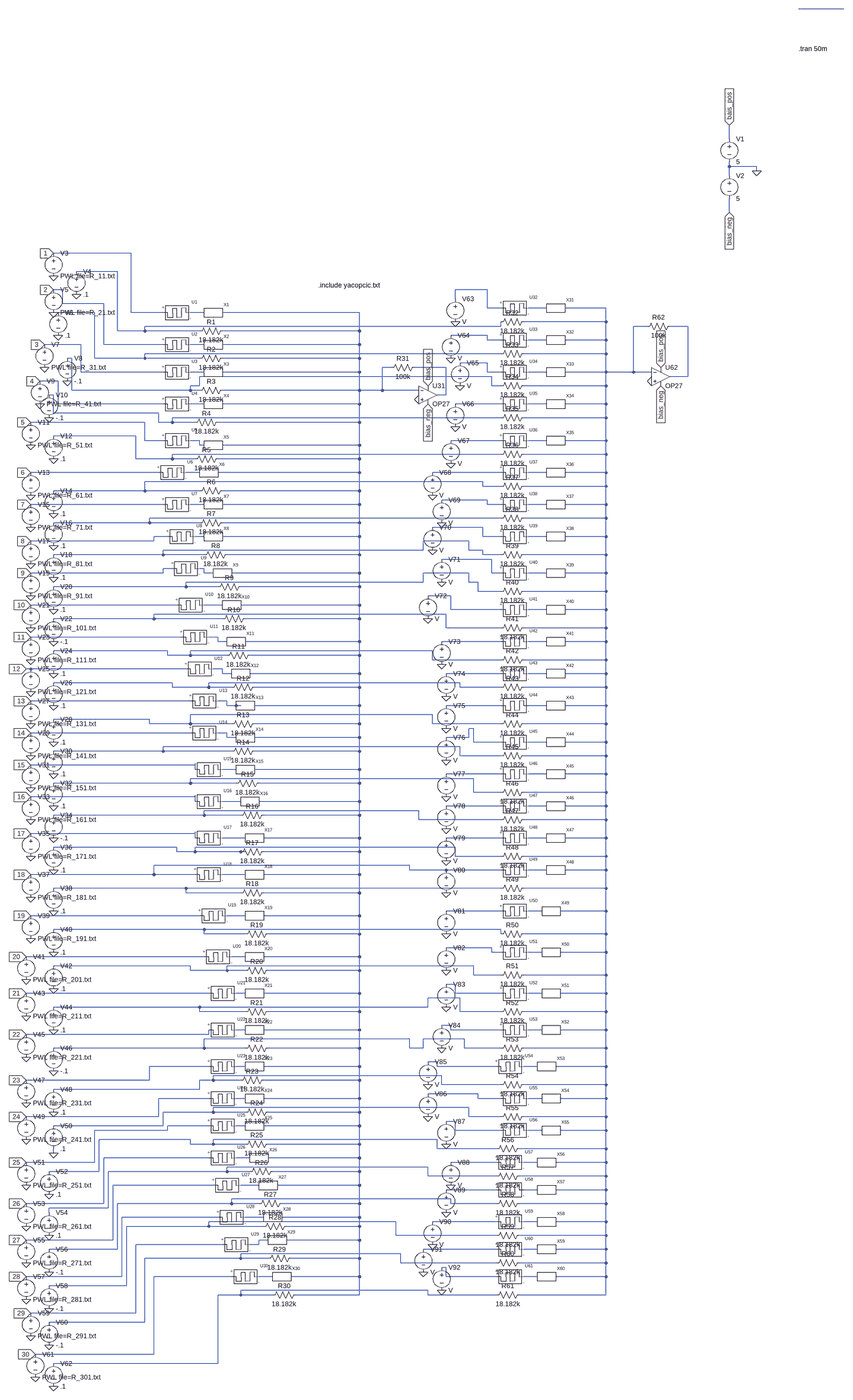
[diagram p0: schematic pattern_memristor.asc, whole sheet]
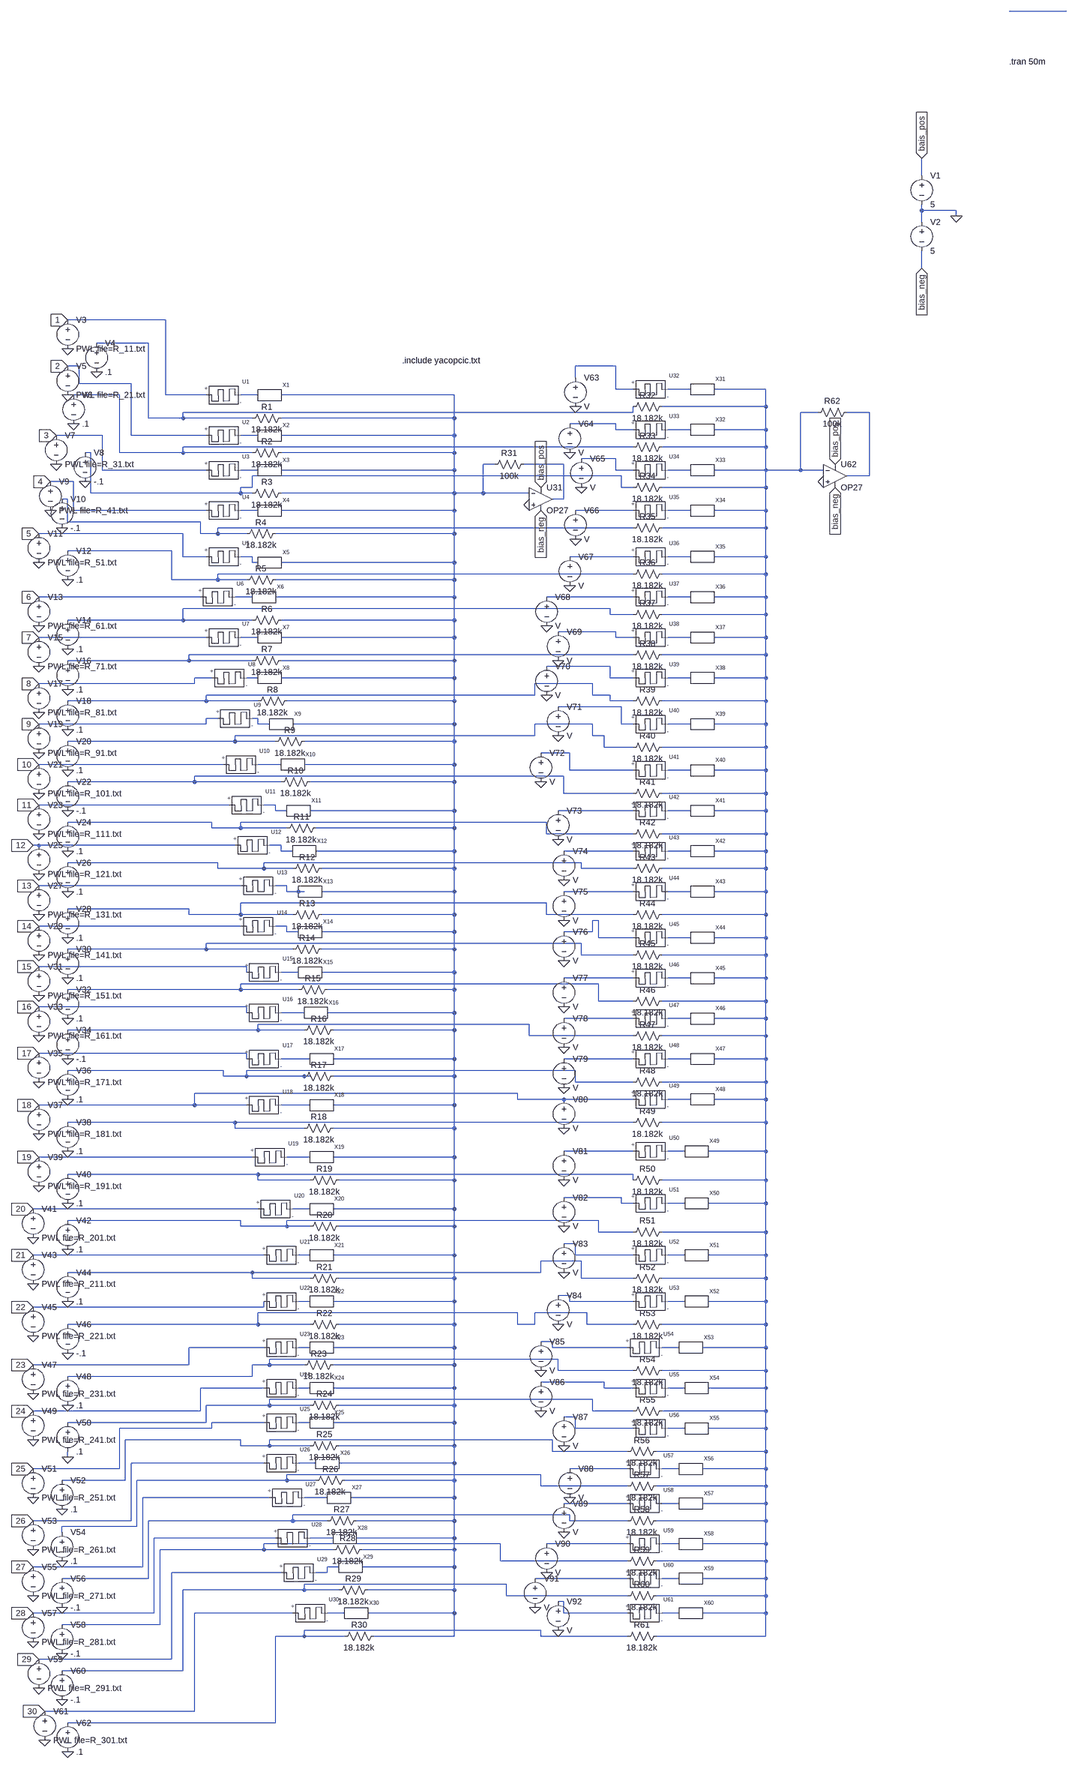
[diagram p1: schematic pattern_memristor.asc, part, row 1 of 1, column 1 of 1]
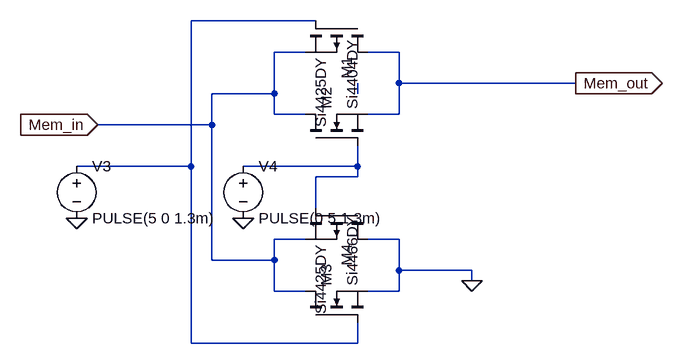
[diagram p2: sub-circuit programmer_with_transmission.asc]
* pattern_memristor.asc
XU1 1 N007 M MEM_YAKOPCIC  ; pins + -
XU2 2 N012 M MEM_YAKOPCIC  ; pins + -
XU3 3 N016 M MEM_YAKOPCIC  ; pins + -
XU4 4 N019 M MEM_YAKOPCIC  ; pins + -
XU5 5 N023 M MEM_YAKOPCIC  ; pins + -
XU6 6 N026 M MEM_YAKOPCIC  ; pins + -
XU7 7 N031 M MEM_YAKOPCIC  ; pins + -
XU8 8 N035 M MEM_YAKOPCIC  ; pins + -
XU9 9 N039 M MEM_YAKOPCIC  ; pins + -
XU10 10 N043 M MEM_YAKOPCIC  ; pins + -
XU11 11 N046 M MEM_YAKOPCIC  ; pins + -
XU12 12 N050 M MEM_YAKOPCIC  ; pins + -
XU13 13 N054 M MEM_YAKOPCIC  ; pins + -
XU14 14 N059 M MEM_YAKOPCIC  ; pins + -
XU15 15 N062 M MEM_YAKOPCIC  ; pins + -
XU16 16 N066 M MEM_YAKOPCIC  ; pins + -
XU17 17 N070 M MEM_YAKOPCIC  ; pins + -
XU18 18 N075 M MEM_YAKOPCIC  ; pins + -
XU19 19 N079 M MEM_YAKOPCIC  ; pins + -
XU20 20 N083 M MEM_YAKOPCIC  ; pins + -
XU21 21 N086 M MEM_YAKOPCIC  ; pins + -
XU22 22 N090 M MEM_YAKOPCIC  ; pins + -
XU23 23 N094 M MEM_YAKOPCIC  ; pins + -
XU24 24 N098 M MEM_YAKOPCIC  ; pins + -
XU25 25 N102 M MEM_YAKOPCIC  ; pins + -
XU26 26 N105 M MEM_YAKOPCIC  ; pins + -
XU27 27 N109 M MEM_YAKOPCIC  ; pins + -
XU28 28 N113 M MEM_YAKOPCIC  ; pins + -
XU29 29 N117 M MEM_YAKOPCIC  ; pins + -
XU30 30 N122 M MEM_YAKOPCIC  ; pins + -
XX1 N007 N008 programmer_with_transmission
XX2 N012 N008 programmer_with_transmission
XX3 N016 N008 programmer_with_transmission
XX4 N019 N008 programmer_with_transmission
XX5 N023 N008 programmer_with_transmission
XX6 N026 N008 programmer_with_transmission
XX7 N031 N008 programmer_with_transmission
XX8 N035 N008 programmer_with_transmission
XX9 N039 N008 programmer_with_transmission
XX10 N043 N008 programmer_with_transmission
XX11 N046 N008 programmer_with_transmission
XX12 N050 N008 programmer_with_transmission
XX13 N054 N008 programmer_with_transmission
XX14 N059 N008 programmer_with_transmission
XX15 N062 N008 programmer_with_transmission
XX16 N066 N008 programmer_with_transmission
XX17 N070 N008 programmer_with_transmission
XX18 N075 N008 programmer_with_transmission
XX19 N079 N008 programmer_with_transmission
XX20 N083 N008 programmer_with_transmission
XX21 N086 N008 programmer_with_transmission
XX22 N090 N008 programmer_with_transmission
XX23 N094 N008 programmer_with_transmission
XX24 N098 N008 programmer_with_transmission
XX25 N102 N008 programmer_with_transmission
XX26 N105 N008 programmer_with_transmission
XX27 N109 N008 programmer_with_transmission
XX28 N113 N008 programmer_with_transmission
XX30 N122 N008 programmer_with_transmission
R1 N008 N002 18.182k
R2 N008 N006 18.182k
R3 N008 N013 18.182k
R4 N008 N018 18.182k
R5 N008 N022 18.182k
R6 N008 N029 18.182k
R7 N008 N033 18.182k
R8 N008 N037 18.182k
R9 N008 N040 18.182k
R10 N008 N045 18.182k
R11 N008 N049 18.182k
R12 N008 N053 18.182k
R13 N008 N057 18.182k
R14 N008 N061 18.182k
R15 N008 N065 18.182k
R16 N008 N069 18.182k
R17 N008 N073 18.182k
R18 N008 N076 18.182k
R19 N008 N080 18.182k
R20 N008 N084 18.182k
R21 N008 N088 18.182k
R22 N008 N092 18.182k
R23 N008 N096 18.182k
R24 N008 N100 18.182k
R25 N008 N104 18.182k
R26 N008 N108 18.182k
R27 N008 N112 18.182k
R28 N008 N114 18.182k
R29 N008 N120 18.182k
R30 N008 N124 18.182k
XX29 N117 N008 programmer_with_transmission
R31 N015 N008 100k
V3 1 0 PWL file=R_11.txt
V4 N002 0 .1
V5 2 0 PWL file=R_21.txt
V6 N006 0 .1
V7 3 0 PWL file=R_31.txt
V8 N013 0 -.1
V9 4 0 PWL file=R_41.txt
V10 N018 0 -.1
V11 5 0 PWL file=R_51.txt
V12 N022 0 .1
V13 6 0 PWL file=R_61.txt
V14 N029 0 .1
V15 7 0 PWL file=R_71.txt
V16 N033 0 .1
V17 8 0 PWL file=R_81.txt
V18 N037 0 .1
V19 9 0 PWL file=R_91.txt
V20 N040 0 .1
V21 10 0 PWL file=R_101.txt
V22 N045 0 -.1
V23 11 0 PWL file=R_111.txt
V24 N049 0 .1
V25 12 0 PWL file=R_121.txt
V26 N053 0 .1
V27 13 0 PWL file=R_131.txt
V28 N057 0 .1
V29 14 0 PWL file=R_141.txt
V30 N061 0 .1
V31 15 0 PWL file=R_151.txt
V32 N065 0 .1
V33 16 0 PWL file=R_161.txt
V34 N069 0 -.1
V35 17 0 PWL file=R_171.txt
V36 N073 0 .1
V37 18 0 PWL file=R_181.txt
V38 N076 0 .1
V39 19 0 PWL file=R_191.txt
V40 N080 0 .1
V41 20 0 PWL file=R_201.txt
V42 N084 0 .1
V43 21 0 PWL file=R_211.txt
V44 N088 0 .1
V45 22 0 PWL file=R_221.txt
V46 N092 0 -.1
V47 23 0 PWL file=R_231.txt
V48 N096 0 .1
V49 24 0 PWL file=R_241.txt
V50 N100 0 .1
V51 25 0 PWL file=R_251.txt
V52 N104 0 .1
V53 26 0 PWL file=R_261.txt
V54 N108 0 .1
V55 27 0 PWL file=R_271.txt
V56 N112 0 -.1
V57 28 0 PWL file=R_281.txt
V58 N114 0 -.1
V59 29 0 PWL file=R_291.txt
V60 N120 0 -.1
V61 30 0 PWL file=R_301.txt
V62 N124 0 .1
XU32 N003 N004 M  ; pins + -
XU33 N010 N011 M  ; pins + -
XU34 N014 N017 M  ; pins + -
XU35 N020 N021 M  ; pins + -
XU36 N024 N025 M  ; pins + -
XU37 N027 N028 M  ; pins + -
XU38 N030 N032 M  ; pins + -
XU39 N034 N036 M  ; pins + -
XU40 N038 N041 M  ; pins + -
XU41 N042 N044 M  ; pins + -
XU42 N047 N048 M  ; pins + -
XU43 N051 N052 M  ; pins + -
XU44 N055 N056 M  ; pins + -
XU45 N058 N060 M  ; pins + -
XU46 N063 N064 M  ; pins + -
XU47 N067 N068 M  ; pins + -
XU48 N071 N072 M  ; pins + -
XU49 18 N074 M  ; pins + -
XU50 N077 N078 M  ; pins + -
XU51 N081 N082 M  ; pins + -
XU52 N085 N087 M  ; pins + -
XU53 N089 N091 M  ; pins + -
XU54 N093 N095 M  ; pins + -
XU55 N097 N099 M  ; pins + -
XU56 N101 N103 M  ; pins + -
XU57 N106 N107 M  ; pins + -
XU58 N110 N111 M  ; pins + -
XU59 N115 N116 M  ; pins + -
XU60 N118 N119 M  ; pins + -
XU61 N121 N123 M  ; pins + -
XX31 N004 N005 programmer_with_transmission
XX32 N011 N005 programmer_with_transmission
XX33 N017 N005 programmer_with_transmission
XX34 N021 N005 programmer_with_transmission
XX35 N025 N005 programmer_with_transmission
XX36 N028 N005 programmer_with_transmission
XX37 N032 N005 programmer_with_transmission
XX38 N036 N005 programmer_with_transmission
XX39 N041 N005 programmer_with_transmission
XX40 N044 N005 programmer_with_transmission
XX41 N048 N005 programmer_with_transmission
XX42 N052 N005 programmer_with_transmission
XX43 N056 N005 programmer_with_transmission
XX44 N060 N005 programmer_with_transmission
XX45 N064 N005 programmer_with_transmission
XX46 N068 N005 programmer_with_transmission
XX47 N072 N005 programmer_with_transmission
XX48 N074 N005 programmer_with_transmission
XX49 N078 N005 programmer_with_transmission
XX50 N082 N005 programmer_with_transmission
XX51 N087 N005 programmer_with_transmission
XX52 N091 N005 programmer_with_transmission
XX53 N095 N005 programmer_with_transmission
XX54 N099 N005 programmer_with_transmission
XX55 N103 N005 programmer_with_transmission
XX56 N107 N005 programmer_with_transmission
XX57 N111 N005 programmer_with_transmission
XX58 N116 N005 programmer_with_transmission
XX59 N119 N005 programmer_with_transmission
XX60 N123 N005 programmer_with_transmission
R32 N005 N002 18.182k
R33 N005 N006 18.182k
R34 N005 N013 18.182k
R35 N005 N018 18.182k
R36 N005 N022 18.182k
R37 N005 N029 18.182k
R38 N005 N033 18.182k
R39 N005 N037 18.182k
R40 N005 N040 18.182k
R41 N005 N045 18.182k
R42 N005 N049 18.182k
R43 N005 N053 18.182k
R44 N005 N057 18.182k
R45 N005 N061 18.182k
R46 N005 N065 18.182k
R47 N005 N069 18.182k
R48 N005 N073 18.182k
R49 N005 N076 18.182k
R50 N005 N080 18.182k
R51 N005 N084 18.182k
R52 N005 N088 18.182k
R53 N005 N092 18.182k
R54 N005 N096 18.182k
R55 N005 N100 18.182k
R56 N005 N104 18.182k
R57 N005 N108 18.182k
R58 N005 N112 18.182k
R59 N005 N114 18.182k
R60 N005 N120 18.182k
R61 N005 N124 18.182k
XU62 0 N005 bias_pos bias_neg N009 OP27  ; pins In+ In- V+ V- OUT
XU31 0 N008 bias_pos bias_neg N015 OP27  ; pins In+ In- V+ V- OUT
V1 bais_pos 0 5
V2 0 bias_neg 5
R62 N009 N005 100k
V63 N003 0 V
V64 N010 0 V
V65 N014 0 V
V66 N020 0 V
V67 N024 0 V
V68 N027 0 V
V69 N030 0 V
V70 N034 0 V
V71 N038 0 V
V72 N042 0 V
V73 N047 0 V
V74 N051 0 V
V75 N055 0 V
V76 N058 0 V
V77 N063 0 V
V78 N067 0 V
V79 N071 0 V
V80 18 0 V
V81 N077 0 V
V82 N081 0 V
V83 N085 0 V
V84 N089 0 V
V85 N093 0 V
V86 N097 0 V
V87 N101 0 V
V88 N106 0 V
V89 N110 0 V
V90 N115 0 V
V91 N118 0 V
V92 N121 0 V

* block symbol definitions
.subckt programmer_with_transmission Mem_in Mem_out
M2 Mem_in N003 Mem_out Mem_out Si4404DY
M3 Mem_in N001 0 0 Si4466DY
V3 N001 0 PULSE(5 0 1.3m)
V4 N003 0 PULSE(0 5 1.3m)
M1 Mem_out N001 Mem_in Mem_in Si4425DY
M4 0 N003 Mem_in Mem_in Si4425DY
.ends programmer_with_transmission

.model NMOS NMOS
.model PMOS PMOS
.lib standard.mos
.include yacopcic.txt
.tran 50m
.lib ADI.lib
.backanno
.end